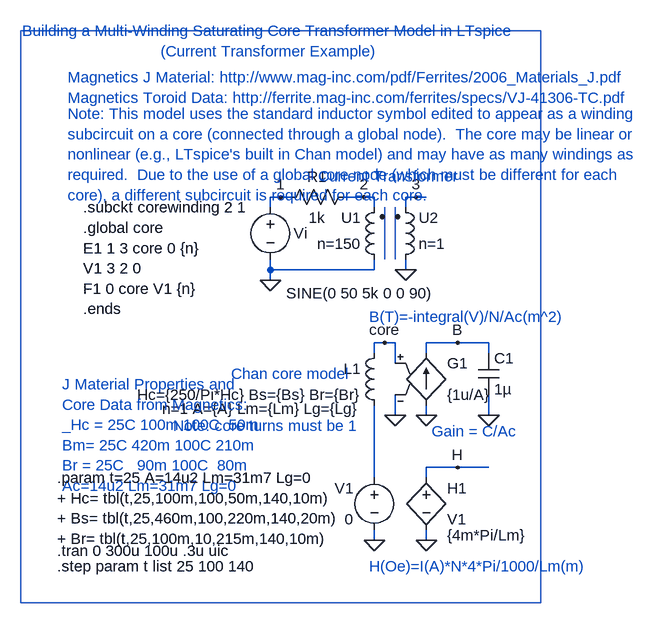
[diagram p0: schematic CurrentSense.asc]
CurrentSense.asc, the LTspice schematic file:
Version 4
SHEET 1 880 752
WIRE -112 112 -128 112
WIRE -96 112 -112 112
WIRE 16 112 -16 112
WIRE 32 112 16 112
WIRE 96 112 80 112
WIRE 112 112 96 112
WIRE -128 128 -128 112
WIRE 32 128 32 112
WIRE 80 128 80 112
WIRE -128 224 -128 208
WIRE 32 224 32 208
WIRE 32 224 -128 224
WIRE 80 224 80 208
WIRE -128 240 -128 224
WIRE 48 336 32 336
WIRE 64 336 48 336
WIRE 160 336 112 336
WIRE 208 336 160 336
WIRE 32 352 32 336
WIRE 112 352 112 336
WIRE 208 352 208 336
WIRE 64 368 64 336
WIRE 64 448 64 416
WIRE 112 448 112 432
WIRE 208 448 208 416
WIRE 160 528 112 528
WIRE 208 528 160 528
WIRE 32 544 32 432
WIRE 112 544 112 528
WIRE 32 640 32 624
WIRE 112 640 112 624
FLAG -128 240 0
FLAG -112 112 1
FLAG 32 640 0
FLAG 48 336 core
FLAG 96 112 3
FLAG 80 224 0
FLAG 16 112 2
FLAG 64 448 0
FLAG 112 448 0
FLAG 208 448 0
FLAG 160 336 B
FLAG 112 640 0
FLAG 160 528 H
SYMBOL ind2 48 224 R180
WINDOW 0 36 80 Left 0
WINDOW 3 36 40 Left 0
SYMATTR InstName U1
SYMATTR Value n=150
SYMATTR Prefix X
SYMATTR Type ind
SYMATTR SpiceModel corewinding
SYMBOL ind2 64 224 M180
WINDOW 0 36 80 Left 0
WINDOW 3 36 40 Left 0
SYMATTR InstName U2
SYMATTR Value n=1
SYMATTR Prefix X
SYMATTR Type ind
SYMATTR SpiceModel corewinding
SYMBOL ind 48 336 M0
WINDOW 123 36 102 Left 0
SYMATTR Value2 n=1 A={A} Lm={Lm} Lg={Lg}
SYMATTR InstName L1
SYMATTR Value Hc={250/Pi*Hc} Bs={Bs} Br={Br}
SYMBOL res 0 96 R90
WINDOW 0 0 56 VBottom 0
WINDOW 3 32 56 VTop 0
SYMATTR InstName R1
SYMATTR Value 1k
SYMBOL g 112 336 R0
WINDOW 0 32 32 Left 0
WINDOW 3 32 80 Left 0
SYMATTR InstName G1
SYMATTR Value {1u/A}
SYMBOL cap 192 352 R0
SYMATTR InstName C1
SYMATTR Value 1µ
SYMBOL voltage 32 528 M0
WINDOW 0 32 32 Left 0
WINDOW 3 32 80 Left 0
SYMATTR InstName V1
SYMATTR Value 0
SYMBOL h 112 528 R0
WINDOW 123 32 104 Left 0
WINDOW 0 32 32 Left 0
WINDOW 3 32 80 Left 0
SYMATTR Value2 {4m*Pi/Lm}
SYMATTR InstName H1
SYMATTR Value V1
SYMBOL voltage -128 112 R0
WINDOW 0 36 56 Left 0
WINDOW 3 24 148 Left 0
WINDOW 123 0 0 Left 0
WINDOW 39 24 126 Left 0
SYMATTR InstName Vi
SYMATTR Value SINE(0 50 5k 0 0 90)
TEXT -456 656 Left 0 !.tran 0 300u 100u .3u uic
TEXT -440 -16 Left 0 ;Note: This model uses the standard inductor symbol edited to appear as a winding \nsubcircuit on a core (connected through a global node).  The core may be linear or \nnonlinear (e.g., LTspice's built in Chan model) and may have as many windings as \nrequired.  Due to the use of a global core node (which must be different for each \ncore), a different subcircuit is required for each core.
TEXT -416 128 Left 0 !.subckt corewinding 2 1\n.global core\nE1 1 3 core 0 {n}\nV1 3 2 0\nF1 0 core V1 {n}\n.ends
TEXT -96 384 Center 0 ;Chan core model
TEXT 120 472 Left 0 ;Gain = C/Ac
TEXT 8 464 Right 0 ;Note: core turns must be 1
TEXT -128 -128 Center 0 ;Building a Multi-Winding Saturating Core Transformer Model in LTspice\n(Current Transformer Example)
TEXT -448 400 Left 0 ;J Material Properties and\nCore Data from Magnetics:\n_Hc = 25C 100m 100C  50m\nBm= 25C 420m 100C 210m\nBr = 25C   90m 100C  80m\nAc=14u2 Lm=31m7 Lg=0
TEXT -456 544 Left 0 !.param t=25 A=14u2 Lm=31m7 Lg=0\n+ Hc= tbl(t,25,100m,100,50m,140,10m)\n+ Bs= tbl(t,25,460m,100,220m,140,20m)\n+ Br= tbl(t,25,100m,10,215m,140,10m)
TEXT -456 680 Left 0 !.step param t list 25 100 140
TEXT 24 680 Left 0 ;H(Oe)=I(A)*N*4*Pi/1000/Lm(m)
TEXT 56 80 Center 0 ;Current Transformer
TEXT -440 -72 Left 0 ;Magnetics J Material: http://www.mag-inc.com/pdf/Ferrites/2006_Materials_J.pdf\nMagnetics Toroid Data: http://ferrite.mag-inc.com/ferrites/specs/VJ-41306-TC.pdf
TEXT 24 296 Left 0 ;B(T)=-integral(V)/N/Ac(m^2)
LINE Normal 48 208 48 128
LINE Normal 64 128 64 208
RECTANGLE Normal 288 736 -512 -144

The netlist it stands for:
* CurrentSense.asc
XU1 0 2 corewinding n=150  ; pins A B
XU2 0 3 corewinding n=1  ; pins A B
L1 core N001 Hc={250/Pi*Hc} Bs={Bs} Br={Br} n=1 A={A} Lm={Lm} Lg={Lg}
R1 2 1 1k
G1 0 B core 0 {1u/A}
C1 B 0 1µ
V1 N001 0 0
H1 H 0 V1 {4m*Pi/Lm}
Vi 1 0 SINE(0 50 5k 0 0 90)
.tran 0 300u 100u .3u uic
* Note: This model uses the standard inductor symbol edited to appear as a winding
* subcircuit on a core (connected through a global node).  The core may be linear or
* nonlinear (e.g., LTspice's built in Chan model) and may have as many windings as
* required.  Due to the use of a global core node (which must be different for each
* core), a different subcircuit is required for each core.
.subckt corewinding 2 1
.global core
E1 1 3 core 0 {n}
V1 3 2 0
F1 0 core V1 {n}
.ends
* Chan core model
* Gain = C/Ac
* Note: core turns must be 1
* Building a Multi-Winding Saturating Core Transformer Model in LTspice
* (Current Transformer Example)
* J Material Properties and
* Core Data from Magnetics:
* _Hc = 25C 100m 100C  50m
* Bm= 25C 420m 100C 210m
* Br = 25C   90m 100C  80m
* Ac=14u2 Lm=31m7 Lg=0
.param t=25 A=14u2 Lm=31m7 Lg=0
+ Hc= tbl(t,25,100m,100,50m,140,10m)
+ Bs= tbl(t,25,460m,100,220m,140,20m)
+ Br= tbl(t,25,100m,10,215m,140,10m)
.step param t list 25 100 140
* H(Oe)=I(A)*N*4*Pi/1000/Lm(m)
* Current Transformer
* Magnetics J Material: http://www.mag-inc.com/pdf/Ferrites/2006_Materials_J.pdf
* Magnetics Toroid Data: http://ferrite.mag-inc.com/ferrites/specs/VJ-41306-TC.pdf
* B(T)=-integral(V)/N/Ac(m^2)
.backanno
.end